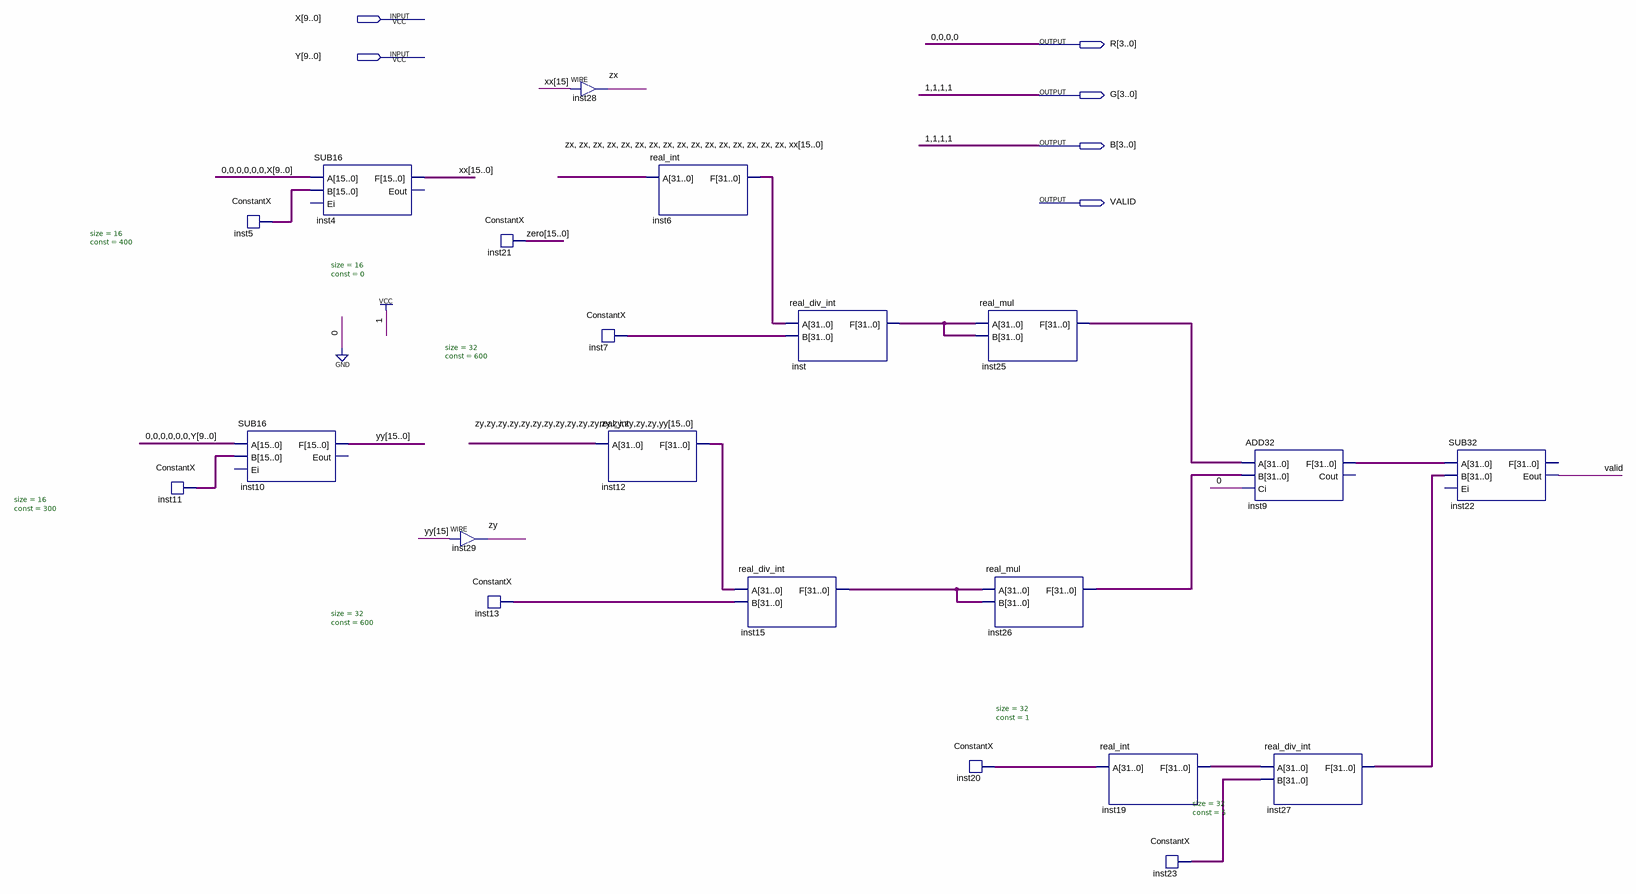
[diagram p0: schematic sheet]
// Quartus schematic Layer_proba.bdf as structural Verilog: 21 symbols, 6 pins
module Layer_proba (
  input  [9:0] X,
  input  [9:0] Y,
  output [3:0] R,
  output [3:0] G,
  output [3:0] B,
  output VALID
);

  wire zx, zy;
  wire [15:0] inst5_data_out, inst11_data_out, xx, yy, zero;
  wire [31:0] inst6_f, inst7_data_out, inst9_f, inst12_f, inst13_data_out, inst15_f, inst19_f,
       inst20_data_out, inst23_data_out, inst25_f, inst26_f, inst27_f, inst_f;

  ConstantX #(.size(16), .\const (300)) inst11 (.DATA_OUT(inst11_data_out));
  ConstantX #(.size(16), .\const (400)) inst5 (.DATA_OUT(inst5_data_out));
  SUB16 inst10 (.A({{6{1'b0}}, Y}), .B(inst11_data_out), .F(yy));  // open: Ei, Eout
  SUB16 inst4 (.A({{6{1'b0}}, X}), .B(inst5_data_out), .F(xx));  // open: Ei, Eout
  assign zy = yy[15];  // WIRE inst29
  ConstantX #(.size(16), .\const (0)) inst21 (.DATA_OUT(zero));
  ConstantX #(.size(32), .\const (600)) inst13 (.DATA_OUT(inst13_data_out));
  assign zx = xx[15];  // WIRE inst28
  ConstantX #(.size(32), .\const (600)) inst7 (.DATA_OUT(inst7_data_out));
  real_int inst12 (.A({{16{zy}}, yy}), .F(inst12_f));
  real_int inst6 (.A({{16{zx}}, xx}), .F(inst6_f));
  real_div_int inst15 (.A(inst12_f), .B(inst13_data_out), .F(inst15_f));
  real_div_int inst (.A(inst6_f), .B(inst7_data_out), .F(inst_f));
  ConstantX #(.size(32), .\const (1)) inst20 (.DATA_OUT(inst20_data_out));
  real_mul inst25 (.A(inst_f), .B(inst_f), .F(inst25_f));
  real_mul inst26 (.A(inst15_f), .B(inst15_f), .F(inst26_f));
  real_int inst19 (.A(inst20_data_out), .F(inst19_f));
  ConstantX #(.size(32), .\const (5)) inst23 (.DATA_OUT(inst23_data_out));
  ADD32 inst9 (.A(inst25_f), .B(inst26_f), .Ci(1'b0), .F(inst9_f));  // open: Cout
  real_div_int inst27 (.A(inst19_f), .B(inst23_data_out), .F(inst27_f));
  SUB32 inst22 (.A(inst9_f), .B(inst27_f), .Eout(VALID));  // open: Ei, F

  assign B = 4'b1111;
  assign G = 4'b1111;
  assign R = 4'b0000;
endmodule
